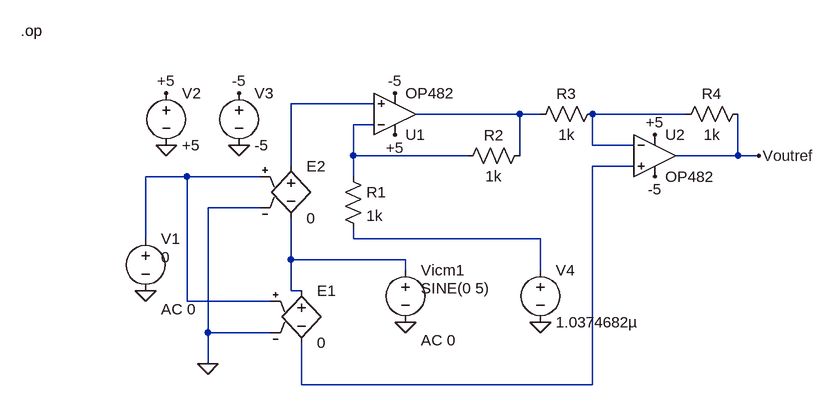
[diagram p0: schematic Etaj1Vref.asc]
Etaj1Vref.asc, the LTspice schematic file:
Version 4.1
SHEET 1 968 1668
WIRE -544 320 -672 320
WIRE -320 336 -480 336
WIRE -288 336 -320 336
WIRE -64 336 -208 336
WIRE -544 352 -576 352
WIRE -208 384 -208 336
WIRE -144 384 -208 384
WIRE -576 400 -576 352
WIRE -400 400 -576 400
WIRE -320 400 -320 336
WIRE 16 400 16 336
WIRE 16 400 -80 400
WIRE 48 400 16 400
WIRE -672 416 -672 320
WIRE -144 416 -208 416
WIRE -832 432 -896 432
WIRE -720 432 -832 432
WIRE -576 432 -576 400
WIRE -720 480 -800 480
WIRE -896 528 -896 432
WIRE -576 528 -576 512
WIRE -288 528 -576 528
WIRE -672 560 -672 496
WIRE -496 560 -672 560
WIRE -496 576 -496 560
WIRE -288 576 -288 528
WIRE -672 608 -672 560
WIRE -656 608 -672 608
WIRE -832 624 -832 432
WIRE -704 624 -832 624
WIRE -800 672 -800 480
WIRE -704 672 -800 672
WIRE -800 720 -800 672
WIRE -656 752 -656 688
WIRE -208 752 -208 416
WIRE -208 752 -656 752
FLAG -512 368 +5
FLAG -512 304 -5
FLAG -112 432 -5
FLAG -112 368 +5
FLAG -800 720 0
FLAG -496 656 0
FLAG 48 400 Voutref
FLAG -896 608 0
FLAG -864 384 0
FLAG -752 384 0
FLAG -864 304 +5
FLAG -752 304 -5
FLAG -288 656 0
DATAFLAG 16 400 ""
SYMBOL OpAmps\\OP482 -512 400 M180
SYMATTR InstName U1
SYMBOL OpAmps\\OP482 -112 336 R0
SYMATTR InstName U2
SYMBOL res -592 416 R0
SYMATTR InstName R1
SYMATTR Value 1k
SYMBOL res -304 384 R90
WINDOW 0 0 56 VBottom 2
WINDOW 3 32 56 VTop 2
SYMATTR InstName R2
SYMATTR Value 1k
SYMBOL res -192 320 R90
WINDOW 0 0 56 VBottom 2
WINDOW 3 32 56 VTop 2
SYMATTR InstName R3
SYMATTR Value 1k
SYMBOL res 32 320 R90
WINDOW 0 0 56 VBottom 2
WINDOW 3 32 56 VTop 2
SYMATTR InstName R4
SYMATTR Value 1k
SYMBOL e -656 592 R0
SYMATTR InstName E1
SYMATTR Value 0
SYMBOL e -672 400 R0
SYMATTR InstName E2
SYMATTR Value 0
SYMBOL voltage -496 560 R0
WINDOW 123 24 124 Left 2
WINDOW 39 0 0 Left 0
WINDOW 3 24 44 Left 2
SYMATTR Value2 AC 0
SYMATTR Value SINE(0 5)
SYMATTR InstName Vicm1
SYMBOL voltage -896 512 R0
WINDOW 123 24 124 Left 2
WINDOW 39 0 0 Left 0
WINDOW 3 24 44 Left 2
SYMATTR Value2 AC 0
SYMATTR Value 0
SYMATTR InstName V1
SYMBOL voltage -864 288 R0
SYMATTR InstName V2
SYMATTR Value +5
SYMBOL voltage -752 288 R0
SYMATTR InstName V3
SYMATTR Value -5
SYMBOL voltage -288 560 R0
WINDOW 123 0 0 Left 0
WINDOW 39 0 0 Left 0
SYMATTR InstName V4
SYMATTR Value 1.0374682µ
TEXT -1088 208 Left 2 !.op

The netlist it stands for:
* Etaj1Vref.asc
X§U1 N001 N004 +5 -5 N002 OP482  ; pins In+ In- V+ V- OUT
X§U2 N005 N003 +5 -5 Voutref OP482  ; pins In+ In- V+ V- OUT
R1 N004 N007 1k
R2 N002 N004 1k
R3 N003 N002 1k
R4 Voutref N003 1k
E1 N008 N005 N006 0 0
E2 N001 N008 N006 0 0
Vicm1 N008 0 SINE(0 5) AC 0
V1 N006 0 0 AC 0
V2 +5 0 +5
V3 -5 0 -5
V4 N007 0 1.0374682µ
.op
.backanno
.end